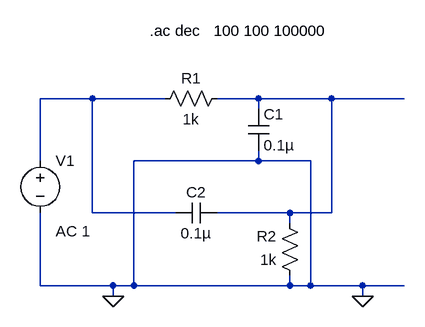
[diagram p0: schematic APF.asc]
APF.asc, the LTspice schematic file:
Version 4
SHEET 1 880 680
WIRE -160 64 -240 64
WIRE -48 64 -160 64
WIRE 96 64 32 64
WIRE 208 64 96 64
WIRE 320 64 208 64
WIRE 96 80 96 64
WIRE -240 160 -240 64
WIRE 96 160 96 144
WIRE 96 160 -96 160
WIRE 176 160 96 160
WIRE -160 240 -160 64
WIRE -32 240 -160 240
WIRE 144 240 32 240
WIRE 208 240 208 64
WIRE 208 240 144 240
WIRE 144 256 144 240
WIRE -240 352 -240 240
WIRE -128 352 -240 352
WIRE -96 352 -96 160
WIRE -96 352 -128 352
WIRE 144 352 144 336
WIRE 144 352 -96 352
WIRE 176 352 176 160
WIRE 176 352 144 352
WIRE 256 352 176 352
WIRE 320 352 256 352
WIRE -128 368 -128 352
WIRE 256 368 256 352
FLAG -128 368 0
FLAG 256 368 0
SYMBOL cap -32 256 R270
WINDOW 0 32 32 VTop 2
WINDOW 3 0 32 VBottom 2
SYMATTR InstName C2
SYMATTR Value 0.1µ
SYMBOL res -64 80 R270
WINDOW 0 32 56 VTop 2
WINDOW 3 0 56 VBottom 2
SYMATTR InstName R1
SYMATTR Value 1k
SYMBOL cap 80 80 R0
SYMATTR InstName C1
SYMATTR Value 0.1µ
SYMBOL res 160 352 R180
WINDOW 0 36 76 Left 2
WINDOW 3 36 40 Left 2
SYMATTR InstName R2
SYMATTR Value 1k
SYMBOL voltage -240 144 R0
WINDOW 123 24 124 Left 2
WINDOW 39 0 0 Left 2
SYMATTR InstName V1
SYMATTR Value ""
SYMATTR Value2 AC 1
TEXT -72 -40 Left 2 !.ac dec   100 100 100000

The netlist it stands for:
* APF.asc
C2 N001 N002 0.1µ
R1 N001 N002 1k
C1 N002 0 0.1µ
R2 0 N002 1k
V1 N001 0 AC 1
.ac dec   100 100 100000
.backanno
.end